# Altium project LED_HOME.PrjPcb
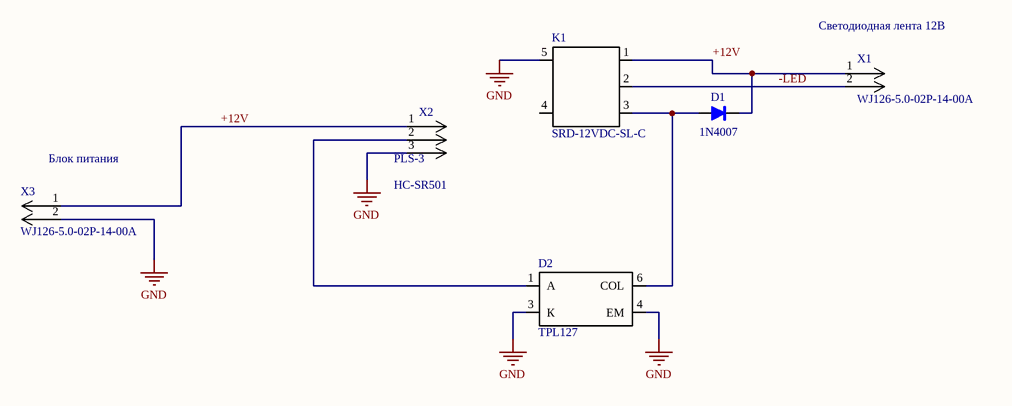
[diagram p0: Sheet1.SchDoc]
1 sheet, 6 parts. Net scope: global (net labels, ports and power ports of the same name join across sheets).
Board file: PCB1.PcbDoc

## Sheet Sheet1.SchDoc
size A4; SheetNumber: 1; SheetTotal: 1; SPICEModelCacheWLPTAMBI: <root> / <DocumentId>WLPTAMBI</DocumentId> / </root>

### Parts
D1  1N4007  [DO-41_BD2.4-P10.16-D0.8-RD]
D2  TPL127  [SOP-4_L3.6-W4.4-P2.54-LS7.0-BL]
K1  SRD-12VDC-SL-C  [REALY-TH_012-1ZW_BK]
X1  WJ126-5.0-02P-14-00A  [WJ126-5.0]
X2  PLS-3  [PLS-3]
X3  WJ126-5.0-02P-14-00A  [WJ126-5.0]

### Nets
GND: D2.3(К) D2.4(EM) K1.5 X2.3 X3.2
+12V: D1.1 K1.1 X1.1 X2.1 X3.1
-LED: K1.2 X1.2
NetD1_2: D1.2 D2.6(COL) K1.3
NetD2_1: D2.1(А) X2.2

Not connected (* = marked no-connect by the designer): K1 4

### Notes on the sheet
- (near X1) Светодиодная лента 12В
- (near X3) Блок питания
- (near X2) HC-SR501

### Library data of the parts
D1 = 1N4007: Diode; Package: DO-41